# Altium project game_console_pcb_design.PrjPcb
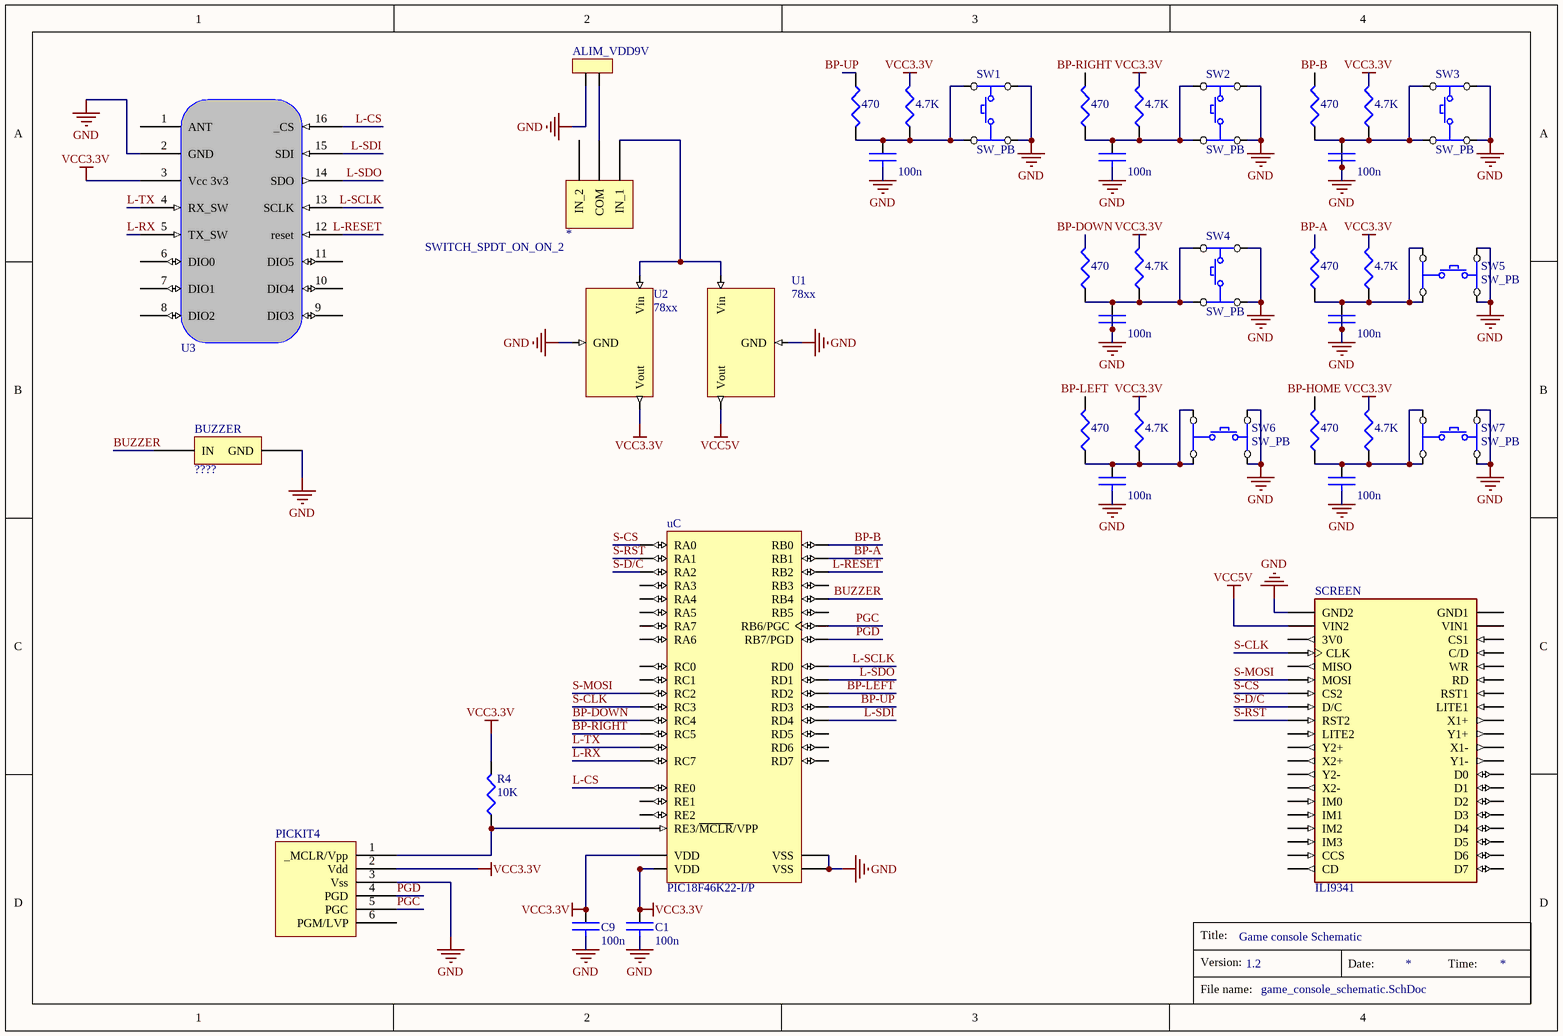
[diagram p0: game_console_schematic.SchDoc]
1 sheet, 40 parts. Net scope: global (net labels, ports and power ports of the same name join across sheets).
Board file: game_console_pcb.PcbDoc

## Sheet game_console_schematic.SchDoc
size A4; SheetNumber: 1; SheetTotal: 2

### Parts
*  SWITCH_SPDT_ON_ON_2  [SW_MFP-161]
ALIM_VDD9V  (no value)  [AMP_2]
BUZZER  ????  [BUZZER]
C1  value 100n  [0402]  (hidden comment: CAP)
C2  value 100n  [0402]  (hidden comment: CAP)
C3  value 100n  [0402]  (hidden comment: CAP)
C4  value 100n  [0402]  (hidden comment: CAP)
C5  value 100n  [0402]  (hidden comment: CAP)
C6  value 100n  [0402]  (hidden comment: CAP)
C7  value 100n  [0402]  (hidden comment: CAP)
C8  value 100n  [0402]  (hidden comment: CAP)
C9  value 100n  [0402]  (hidden comment: CAP)
PICKIT4  (no value)  [PIC-ICSP]
R1  value 470  [0201]  (hidden comment: RES)
R2  value 4.7K  [0201]  (hidden comment: RES)
R4  value 10K  [0201]  (hidden comment: RES)
R12  value 470  [0201]  (hidden comment: RES)
R13  value 4.7K  [0201]  (hidden comment: RES)
R14  value 470  [0201]  (hidden comment: RES)
R15  value 4.7K  [0201]  (hidden comment: RES)
R16  value 470  [0201]  (hidden comment: RES)
R17  value 4.7K  [0201]  (hidden comment: RES)
R18  value 470  [0201]  (hidden comment: RES)
R19  value 4.7K  [0201]  (hidden comment: RES)
R20  value 470  [0201]  (hidden comment: RES)
R21  value 4.7K  [0201]  (hidden comment: RES)
R22  value 470  [0201]  (hidden comment: RES)
R23  value 4.7K  [0201]  (hidden comment: RES)
SCREEN  ILI9341  [ADAFRUIT_2478]
SW1  SW_PB  [KSA]
SW2  SW_PB  [KSA]
SW3  SW_PB  [KSA]
SW4  SW_PB  [KSA]
SW5  SW_PB  [KSA]
SW6  SW_PB  [KSA]
SW7  SW_PB  [KSA]
U1  78xx  [TO220H]
U2  78xx  [TO220H]
U3  RF-LORA-868-SO  [RF-LORA-868-DIP]  (value not drawn)
uC  PIC18F46K22-I/P  [MCHP-PDIP-P40]

### Nets
GND: ALIM_VDD9V.2 BUZZER.2(GND) C1.2 C2.2 C3.2 C4.2 C5.2 C6.2 C7.2 C8.2 C9.2 PICKIT4.3(Vss) SCREEN.21(GND2) SW1.2 SW1.4 SW2.2 SW2.4 SW3.2 SW3.4 SW4.2 SW4.4 SW5.3 SW5.4 SW6.3 SW6.4 SW7.3 SW7.4 U1.2(GND) U2.2(GND) U3.2(GND) uC.12(VSS) uC.31(VSS)
VCC3.3V: C1.1 C9.1 PICKIT4.2(Vdd) R2.2 R4.2 R13.2 R15.2 R17.2 R19.2 R21.2 R23.2 U2.3(Vout) U3.3(Vcc_3v3) uC.11(VDD) uC.32(VDD)
VCC5V: SCREEN.22(VIN2) U1.3(Vout)
BP-A: R22.2 uC.34(RB1)
BP-B: R16.2 uC.33(RB0)
BP-DOWN: R20.2 uC.23(RC4)
BP-HOME: R1.2
BP-LEFT: R18.2 uC.21(RD2)
BP-RIGHT: R14.2 uC.24(RC5)
BP-UP: R12.1 uC.22(RD3)
BUZZER: BUZZER.1(IN) uC.37(RB4)
L-CS: U3.16(_CS) uC.8(RE0)
L-RESET: U3.12(reset) uC.35(RB2)
L-RX: U3.5(TX_SW) uC.26(RC7)
L-SCLK: U3.13(SCLK) uC.19(RD0)
L-SDI: U3.15(SDI) uC.27(RD4)
L-SDO: U3.14(SDO) uC.20(RD1)
L-TX: U3.4(RX_SW) uC.25(RC6)
PGC: PICKIT4.5(PGC) uC.39(RB6/PGC)
PGD: PICKIT4.4(PGD) uC.40(RB7/PGD)
S-CLK: SCREEN.24(CLK) uC.18(RC3)
S-CS: SCREEN.27(CS2) uC.2(RA0)
S-D/C: SCREEN.28(D/C) uC.4(RA2)
S-MOSI: SCREEN.26(MOSI) uC.17(RC2)
S-RST: SCREEN.29(RST2) uC.3(RA1)
Net*_1: *.1(IN_1) U1.1(Vin) U2.1(Vin)
Net*_2: *.2(COM) ALIM_VDD9V.1
NetC2_1: C2.1 R12.2 R13.1 SW1.1 SW1.3
NetC3_1: C3.1 R14.1 R15.1 SW2.1 SW2.3
NetC4_1: C4.1 R16.1 R17.1 SW3.1 SW3.3
NetC5_1: C5.1 R18.1 R19.1 SW6.1 SW6.2
NetC6_1: C6.1 R20.1 R21.1 SW4.1 SW4.3
NetC7_1: C7.1 R22.1 R23.1 SW5.1 SW5.2
NetC8_1: C8.1 R1.1 R2.1 SW7.1 SW7.2
NetPICKIT4_1: PICKIT4.1(_MCLR/Vpp) R4.1 uC.1(RE3/~{MCLR}/VPP)

Not connected (* = marked no-connect by the designer): * 3(IN_2); PICKIT4 6(PGM/LVP); SCREEN 1(GND1) 2(VIN1) 3(CS1) 4(C/D) 5(WR) 6(RD) 7(RST1) 8(LITE1) 9(X1+) 10(Y1+) 11(X1-) 12(Y1-) 13(D0) 14(D1) 15(D2) 16(D3) 17(D4) 18(D5) 19(D6) 20(D7) 23(3V0) 25(MISO) 30(LITE2) 31(Y2+) 32(X2+) 33(Y2-) 34(X2-) 35(IM0) 36(IM1) 37(IM2) 38(IM3) 39(CCS) 40(CD); U3 1(ANT) 6(DIO0) 7(DIO1) 8(DIO2) 9(DIO3) 10(DIO4) 11(DIO5); uC 5(RA3) 6(RA4) 7(RA5) 9(RE1) 10(RE2) 13(RA7) 14(RA6) 15(RC0) 16(RC1) 28(RD5) 29(RD6) 30(RD7) 36(RB3) 38(RB5)

### Notes on the sheet
- 1.2
- Game console Schematic
- Title:
- Version:
- Date:
- Time:
- File name:

### Library data of the parts
ALIM_VDD9V = POWER2: connecteur alim 2 pôles
BUZZER = BUZZER
C1-C9 = CAP: capacité non polarisée
PICKIT4 = PIC-ICSP
R1 R2 R4 R12-R23 = RES: resistance
SCREEN = 2478: Resistive Graphic LCD Display Module Red, Green, Blue (RGB) TFT - Color Parallel, 8-Bit, SPI 2.4 (60.96mm) 240 x 320; MF: Adafruit Industries; Package: NON STANDARD Adafruit; Price: None; Value: *; SnapEDA_Link: https://www.snapeda.com/parts/2478/Adafruit+Industries+LLC/view-part/?ref=snap; MP: 2478; Availability: In Stock; Check_prices: https://www.snapeda.com/parts/2478/Adafruit+Industries+LLC/view-part/?ref=eda
U1 U2 = REG_POS: régulateur positif fixe
uC = PIC18F46K22-I/P: Low-Power, High-Performance Microcontroller with XLP Technology, 64 MHz, 35 I/O, -40 to 85 degC, 40-pin PDIP (P40), Tube; Manufacturer: Microchip; # of A/D Channels: 28; Digital Communication: 2 -A/E/USART, 2 -MSSP(SPI/I2C); EEPROM Data Memory (bytes): 1024; I/O Pins: 35; Internal Oscillator: 16 MHz, 31 kHz; Max. CPU Speed MHz: 64; Memory Type: Flash; Operation Voltage Range: 2.3V - 5.5V; Program Memory KWords: 32; RAM: 3896; Timers: 3 - 8-bit, 4 - 16-bit; DatasheetVersion: Rev. F; PackageVersion: C04-016B, 04/2013; PackageReference: PDIP-P40; PackageDescription: 40-Lead Plastic Dual In-Line Package, Body 51.75 x 13.53 mm, Pitch 2.54 mm; Supplier 1: Digi-Key; Supplier Part Number 1: PIC18F46K22-I/P-ND; Supplier 2: Farnell; Supplier Part Number 2: 1814979; Supplier 3: Newark; Supplier Part Number 3: 65R6012; Supplier 4: Mouser; Supplier Part Number 4: 579-PIC18F46K22IP; Packing: TUBE; Program Memory KBytes: 64; RoHS: TRUE; Mounting Technology: Through Hole; PartNumber: PIC18F46K22-I/P; ComponentLink1Description: Datasheet; ComponentLink1URL: http://ww1.microchip.com/downloads/en/DeviceDoc/41412F.pdf; ComponentLink2Description: Package Specification; ComponentLink2URL: http://www.microchip.com/stellent/groups/techpub_sg/documents/packagingspec/en012702.pdf; ComponentLink3Description: URL Link1; ComponentLink3URL: Product URL:http://www.microchip.com/datasheet/PIC18F46K22